# Altium schematic sheet Power.SchDoc
size 292 x 193 mm; DocumentNumber: 10; SheetNumber: 10; SheetTotal: 11
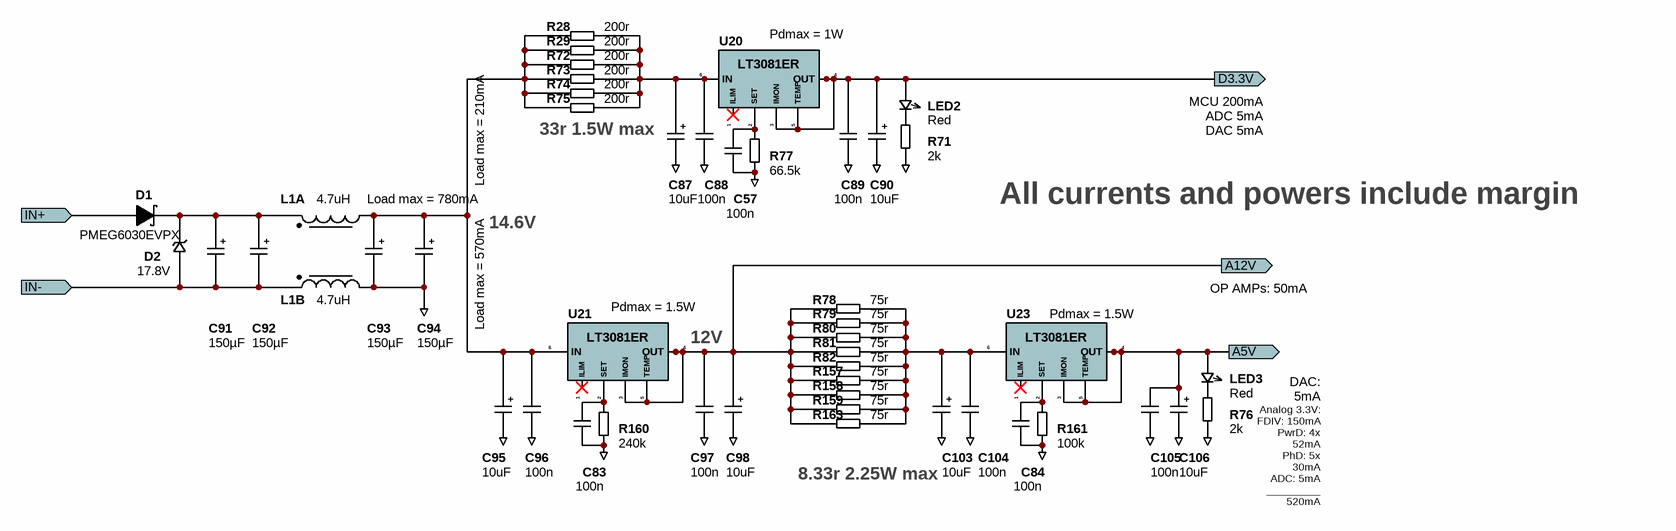
[diagram p0: Power.SchDoc]

## Parts
C57  100n  [0402-Capacitor]  (net tie, no BOM)
C83  100n  [0402-Capacitor]
C84  100n  [0402-Capacitor]  (net tie, no BOM)
C87  10uF  [2312-6032 Tantalum Capacitor]
C88  100n  [0402-Capacitor]  (net tie, no BOM)
C89  100n  [0402-Capacitor]  (net tie, no BOM)
C90  10uF  [2312-6032 Tantalum Capacitor]
C91  150µF  [2917-7343  Tantalum Capacitor]
C92  150µF  [2917-7343  Tantalum Capacitor]
C93  150µF  [2917-7343  Tantalum Capacitor]
C94  150µF  [2917-7343  Tantalum Capacitor]
C95  10uF  [2312-6032 Tantalum Capacitor]
C96  100n  [0402-Capacitor]  (net tie, no BOM)
C97  100n  [0402-Capacitor]  (net tie, no BOM)
C98  10uF  [2312-6032 Tantalum Capacitor]
C103  10uF  [2312-6032 Tantalum Capacitor]
C104  100n  [0402-Capacitor]  (net tie, no BOM)
C105  100n  [0402-Capacitor]  (net tie, no BOM)
C106  10uF  [2312-6032 Tantalum Capacitor]
D1  PMEG6030EVPX  [SOD128]
D2  17.8V  [DO-219AB]
L1  4.7uH  [LPD5030]  (parts A,B of 2)
LED2  Red  [LED0603]
LED3  Red  [LED0603]
R28  200r  [1210-Resistor]
R29  200r  [1210-Resistor]
R71  2k  [0402-RESISTOR]
R72  200r  [1210-Resistor]
R73  200r  [1210-Resistor]
R74  200r  [1210-Resistor]
R75  200r  [1210-Resistor]
R76  2k  [0402-RESISTOR]
R77  66.5k  [0805-Resistor]
R78  75r  [1210-Resistor]
R79  75r  [1210-Resistor]
R80  75r  [1210-Resistor]
R81  75r  [1210-Resistor]
R82  75r  [1210-Resistor]
R157  75r  [1210-Resistor]
R158  75r  [1210-Resistor]
R159  75r  [1210-Resistor]
R160  240k  [0805-Resistor]
R161  100k  [0805-Resistor]
R163  75r  [1210-Resistor]
U20  ADJ  [D2PAK7]  (value not drawn)
U21  ADJ  [D2PAK7]  (value not drawn)
U23  ADJ  [D2PAK7]  (value not drawn)

## Ports
A5V (out), A12V (out), D3.3V (out), IN+ (in), IN- (in)

## Nets
GND: C57.1 C83.1 C84.1 C87.- C88.1 C89.1 C90.- C93.- C94.- C95.- C96.1 C97.1 C98.- C103.- C104.1 C105.1 C106.- L1.3 R71.1 R76.1 R77.1 R160.1 R161.1
A5V: C105.2 C106.+ LED3.A U23.3(IMON) U23.4(OUT) U23.5(TEMP) U23.EP(OUT) ; port A5V
A12V: C97.2 C98.+ R78.1 R79.1 R80.1 R81.1 R82.1 R157.1 R158.1 R159.1 R163.1 U21.3(IMON) U21.4(OUT) U21.5(TEMP) U21.EP(OUT) ; port A12V
D3.3V: C89.2 C90.+ LED2.A U20.3(IMON) U20.4(OUT) U20.5(TEMP) U20.EP(OUT) ; port D3.3V
IN+: D1.1(A) ; port IN+
IN-: C91.- C92.- D2.A L1.4 ; port IN-
NetC57_2: C57.2 R77.2 U20.2(SET)
NetC83_2: C83.2 R160.2 U21.2(SET)
NetC84_2: C84.2 R161.2 U23.2(SET)
NetC87_+: C87.+ C88.2 R28.2 R29.2 R72.2 R73.2 R74.2 R75.2 U20.6(IN)
NetC91_+: C91.+ C92.+ D1.2(K) D2.K L1.1
NetC93_+: C93.+ C94.+ C95.+ C96.2 L1.2 R28.1 R29.1 R72.1 R73.1 R74.1 R75.1 U21.6(IN)
NetC103_+: C103.+ C104.2 R78.2 R79.2 R80.2 R81.2 R82.2 R157.2 R158.2 R159.2 R163.2 U23.6(IN)
NetLED2_K: LED2.K R71.2
NetLED3_K: LED3.K R76.2

Not connected (* = marked no-connect by the designer): U20 1(ILIM)* 7(NC); U21 1(ILIM)* 7(NC); U23 1(ILIM)* 7(NC)

## Notes on the sheet
- (near U20) Pdmax = 1W
- (near R75) 33r 1.5W max
- MCU 200mA
  ADC 5mA
  DAC 5mA
- (near L1) Load max = 780mA
- Load max = 210mA
- 14.6V
- All currents and powers include margin
- (near U21) Pdmax = 1.5W
- (near U23) Pdmax = 1.5W
- OP AMPs: 50mA
- Load max = 570mA
- (near U21) 12V
- DAC: 5mA
  ATT: 2mA
- 8.33r 2.25W max
- Analog 3.3V:
  FDIV: 150mA
  PwrD: 4x 52mA
  PhD: 5x 30mA
  ADC: 5mA
  _________
  520mA
- Title
- Project
- Drawing no.
- Date
- Drawn by
- Checked by
- Revision

## Library data of the parts
C57 C83 C84 C88 C89 C96 C97 C104 C105 = C_0402: Capacitor 0402; Tolerance: ±20%; Voltage Rating: 16V; Dielectric: X7R/C0G; Value: 100n; Case: 0402
C87 C90 C95 C98 C103 C106 = C_10uF_Tant_25V_2312: CAP TANT 10UF 10% 25V 2312; Value: 10uF; Voltage Rating: 25V; Supplier 1: Digi-Key; Supplier Part Number 1: 399-3734-1-ND; Case: 2312; HelpURL: https://content.kemet.com/datasheets/KEM_T2005_T491.pdf
C91-C94 = T491X157K020AT: 150µF Molded Tantalum Capacitors 20V 2917; Tolerance: ±10%; Value: 150µF; Voltage Rating: 20V; Supplier 1: Digi-Key; Supplier Part Number 1: 399-4794-1-ND; Case: 2917; HelpURL: https://content.kemet.com/datasheets/KEM_T2005_T491.pdf
D1 = PMEG6030EVPX: Diode Schottky 60V 3A Surface Mount SOD-128/CFP5; Manufacturer: Nexperia USA Inc.; Pin Count: 2; Package: SOD128; ManufacturerNr: PMEG6030EVPX; HelpURL: https://assets.nexperia.com/documents/data-sheet/PMEG6030EVP.pdf; Supplier 1: Digi-Key; Supplier Part Number 1: 1727-1349-1-ND
D2 = SMF16A-E3-08: 26V Clamp 7.7A Ipp Tvs Diode Surface Mount SMF; HelpURL: http://www.vishay.com/docs/85881/smf5v0atosmf58a.pdf; Case: DO-219AB; Supplier 1: Digi-Key; Supplier Part Number 1: SMF16A-E3-08GICT-ND
L1 = LPD5030: Shielded Coupled Inductor; Voltage Rating: 100 V; Tolerance: 20%; HelpURL: http://www.farnell.com/datasheets/1862246.pdf?_ga=2.57899747.877596875.1505932278-516227586.1495631175; Supplier 1: Farnell; Supplier Part Number 1: 2434738; Value: 4.7uH; Case: LPD5030
LED2 LED3 = LED0603: Color: Red; Case: 0603
R28 R29 R72-R75 R78-R82 R157-R159 R163 = R_1210: Resistor 1210; Tolerance: ±1%; Case: 1210
  R28 R29 R72-R75: Value: 200r
  R78-R82 R157-R159 R163: Value: 75r
R71 R76 = R_0402: Resistor 0402; Tolerance: ±1%; Value: 2k; Case: 0402
R77 R160 R161 = R_0805: Resistor 0805; Tolerance: ±1%; Case: 0805
  R77: Value: 66.5k
  R160: Value: 240k
  R161: Value: 100k
U20 U21 U23 = LT3081ER: 1.5A Single Resistor / Rugged Linear Regulator / with Monitors; HelpURL: analog.com/media/en/technical-documentation/data-sheets/3081fc.pdf; Case: 7-DDPAK; Supplier 1: Digi-Key; Supplier Part Number 1: LT3081ER#PBF-ND